# Altium schematic sheet 06_LEDs.SchDoc: ECE315 Analog
size A; Date: 4/25/2017; ApprovedBy: JSK; CheckedBy: JSK; Author: JSK; CompanyName: University of Wisconsin; DrawnBy: JSK; Engineer: JSK; Organization: ECE 315; Address1: College of Engineering; Address2: 1415 Engineering Drive; Address3: Madison, WI 53706; Address4: ECE 315 Fall 2017; Revision: A; SheetNumber: 2; SheetTotal: 2; AssemblyNumber: ECE315-F19; ApprovedDate: 04/02/2019
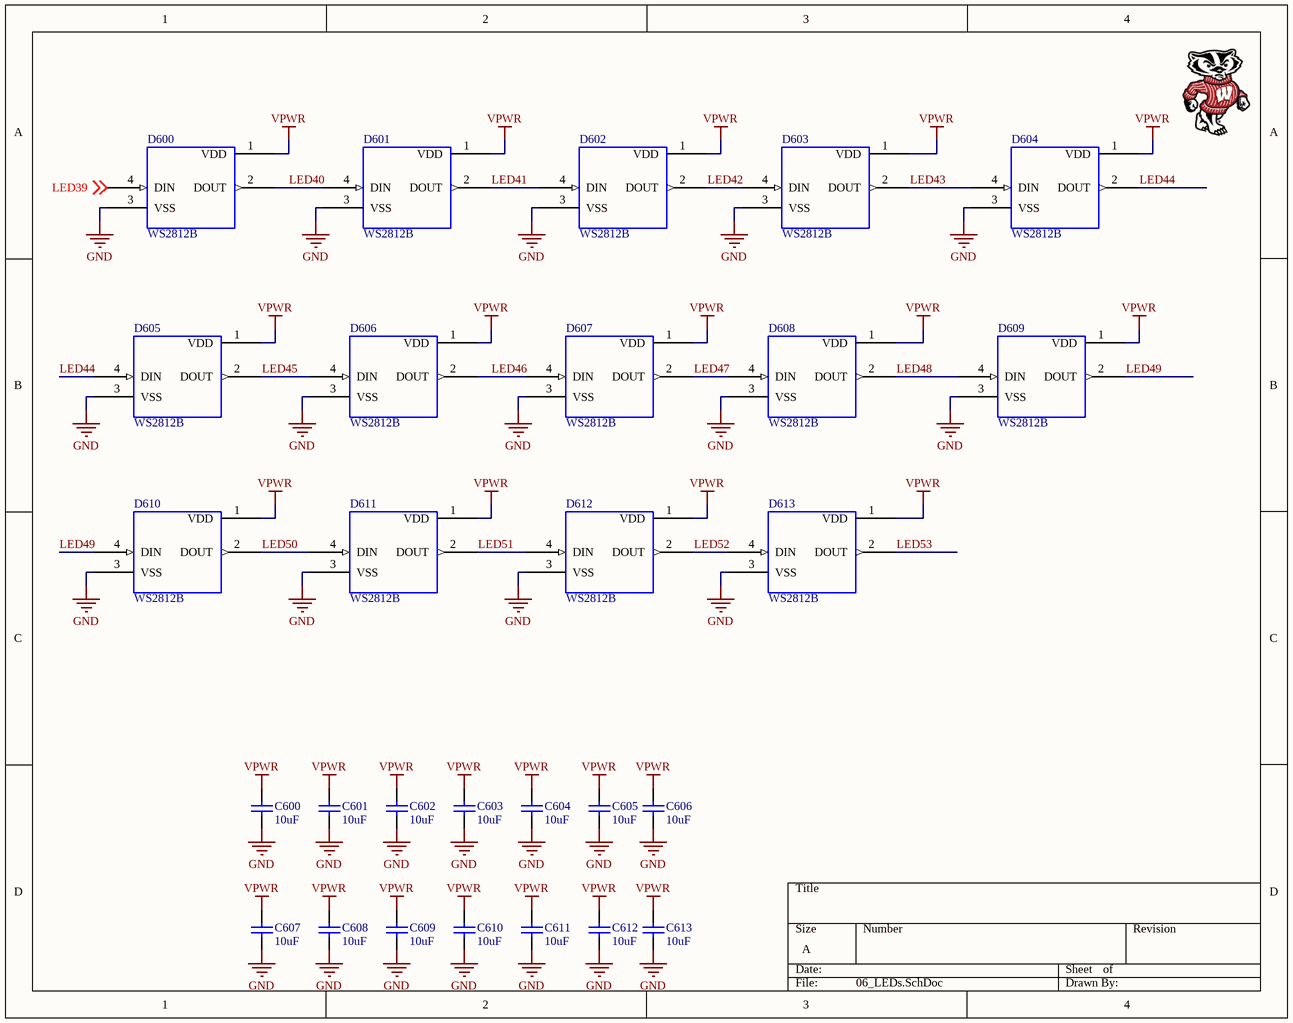
[diagram p0: 06_LEDs.SchDoc]

## Parts
C600  10uF  [CAP_0805]
C601  10uF  [CAP_0805]
C602  10uF  [CAP_0805]
C603  10uF  [CAP_0805]
C604  10uF  [CAP_0805]
C605  10uF  [CAP_0805]
C606  10uF  [CAP_0805]
C607  10uF  [CAP_0805]
C608  10uF  [CAP_0805]
C609  10uF  [CAP_0805]
C610  10uF  [CAP_0805]
C611  10uF  [CAP_0805]
C612  10uF  [CAP_0805]
C613  10uF  [CAP_0805]
D600  WS2812B  [WS2812B]
D601  WS2812B  [WS2812B]
D602  WS2812B  [WS2812B]
D603  WS2812B  [WS2812B]
D604  WS2812B  [WS2812B]
D605  WS2812B  [WS2812B]
D606  WS2812B  [WS2812B]
D607  WS2812B  [WS2812B]
D608  WS2812B  [WS2812B]
D609  WS2812B  [WS2812B]
D610  WS2812B  [WS2812B]
D611  WS2812B  [WS2812B]
D612  WS2812B  [WS2812B]
D613  WS2812B  [WS2812B]

## Nets
GND: C600.1 C601.1 C602.1 C603.1 C604.1 C605.1 C606.1 C607.1 C608.1 C609.1 C610.1 C611.1 C612.1 C613.1 D600.3(VSS) D601.3(VSS) D602.3(VSS) D603.3(VSS) D604.3(VSS) D605.3(VSS) D606.3(VSS) D607.3(VSS) D608.3(VSS) D609.3(VSS) D610.3(VSS) D611.3(VSS) D612.3(VSS) D613.3(VSS)
VPWR: C600.2 C601.2 C602.2 C603.2 C604.2 C605.2 C606.2 C607.2 C608.2 C609.2 C610.2 C611.2 C612.2 C613.2 D600.1(VDD) D601.1(VDD) D602.1(VDD) D603.1(VDD) D604.1(VDD) D605.1(VDD) D606.1(VDD) D607.1(VDD) D608.1(VDD) D609.1(VDD) D610.1(VDD) D611.1(VDD) D612.1(VDD) D613.1(VDD)
LED39: D600.4(DIN) ; off-sheet LED39
LED40: D600.2(DOUT) D601.4(DIN)
LED41: D601.2(DOUT) D602.4(DIN)
LED42: D602.2(DOUT) D603.4(DIN)
LED43: D603.2(DOUT) D604.4(DIN)
LED44: D604.2(DOUT) D605.4(DIN)
LED45: D605.2(DOUT) D606.4(DIN)
LED46: D606.2(DOUT) D607.4(DIN)
LED47: D607.2(DOUT) D608.4(DIN)
LED48: D608.2(DOUT) D609.4(DIN)
LED49: D609.2(DOUT) D610.4(DIN)
LED50: D610.2(DOUT) D611.4(DIN)
LED51: D611.2(DOUT) D612.4(DIN)
LED52: D612.2(DOUT) D613.4(DIN)
LED53: D613.2(DOUT)

## Library data of the parts
C600-C613 = CAP_0805_U_010.00: CAP CER 10UF 16V X7R 0805; Manufacturer: Samsung; Manufacturer Part Number: CL21A106KPCLQNC; Tolerance: 10%; Voltage Rating: 10V; Dielectric: X5R; ComponentLink3URL: https://datasheet.ciiva.com/26920/getdatasheetpartid-355170-26920201.pdf; ComponentLink3Description: https://datasheet.ciiva.com/26920/getdatasheetpartid-355170-26920201.pdf; Supplier 1: Digi-Key; Stock 1: 40000; Pricing 1: 1=0.22, 10=0.148, 100=0.0749, 500=0.05122, 1000=0.04531 (USD); Mount: Surface Mount; Case/Package: 0805; Case Code (Metric): 2012; Case Code (Imperial): 0805; Contact Plating: Tin; Min Operating Temperature: -55°C; Max Operating Temperature: 85°C; Packaging: Tape and Reel; Package Quantity: 1; Length: 2mm; Height: 0.85mm; Width: 0.049inch; Thickness: 0.037inch; Depth: 1.25mm; Radiation Hardening: No; ComponentLink1URL: https://datasheet.ciiva.com/25730/cl21a106kpclqnc-25730594.pdf; ComponentLink1Description: https://datasheet.ciiva.com/25730/cl21a106kpclqnc-25730594.pdf; Supplier Part Number 1: 1276-2402-1-ND; Capacitance: 10uF
D600-D613 = WS2812B: LED RGB WS2812B; Manufacturer Part Number: EBAY; Rating: 3.5V-5.3V; Value: WS2812B